# EAGLE design OC2_2boards (EAGLE 7.7.0)
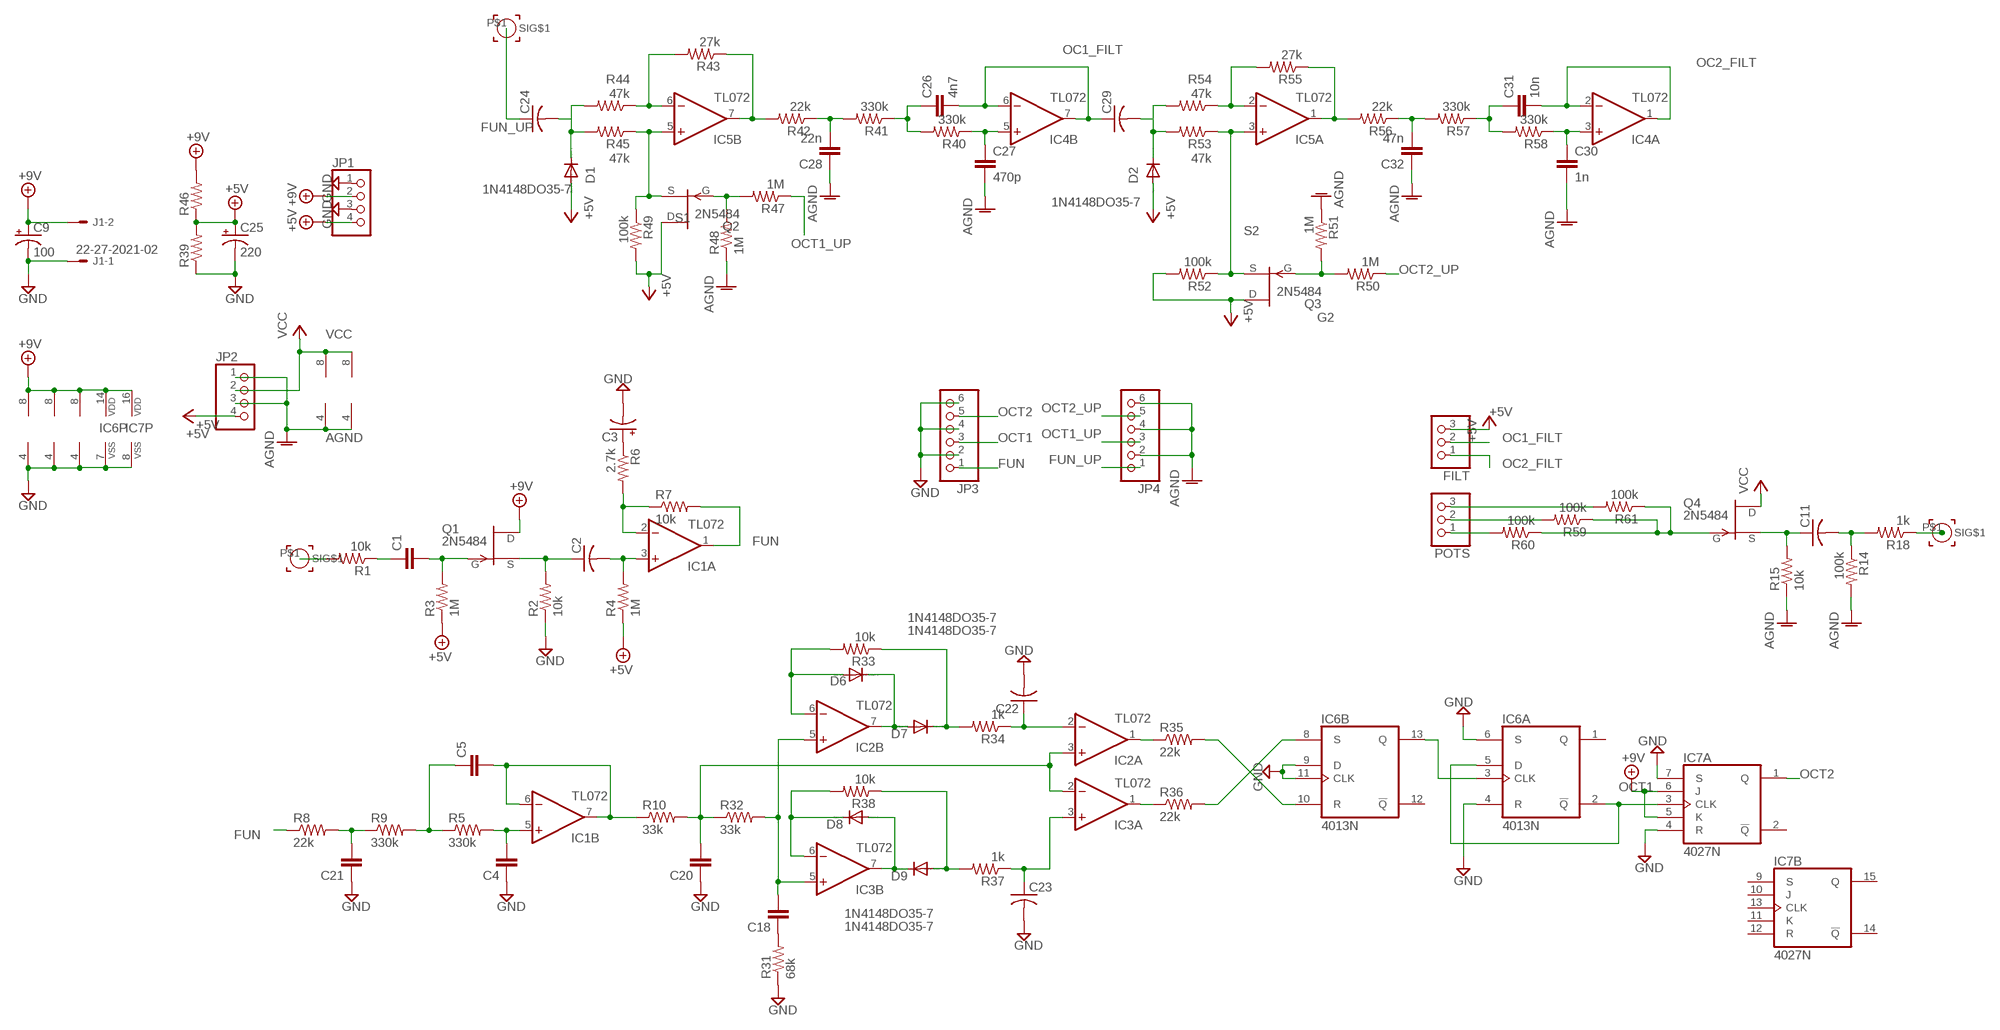
[diagram p0: schematic, sheet 1]

## Parts
C1  C-EU  [C025-025X050-BP]
C2  C-US  [C050-024X044-BP]
C3  CPOL-USE2.5-5  [E2,5-5]
C4  C-EU  [C025-025X050-BP]
C5  C-EU  [C025-025X050-BP]
C9  100  CPOL-USE2.5-6  [E2,5-6]
C11  C-US  [C050-024X044-BP]
C18  C-EU  [C025-025X050-BP]
C20  C-EU  [C025-025X050-BP]
C21  C-EU  [C025-025X050-BP]
C22  C-US  [C050-024X044-BP]
C23  C-US  [C050-024X044-BP]
C24  C-US  [C050-024X044-BP]
C25  220  CPOL-USE3.5-8  [E3,5-8]
C26  4n7  C-EU  [C025-025X050-BP]
C27  470p  C-EU  [C025-025X050-BP]
C28  22n  C-EU  [C025-025X050-BP]
C29  C-US  [C050-024X044-BP]
C30  1n  C-EU  [C025-025X050-BP]
C31  10n  C-EU  [C025-025X050-BP]
C32  47n  C-EU  [C025-025X050-BP]
D1  1N4148DO35-7  [DO35-7]
D2  1N4148DO35-7  [DO35-7]
D6  1N4148DO35-7  [DO35-7]
D7  1N4148DO35-7  [DO35-7]
D8  1N4148DO35-7  [DO35-7]
D9  1N4148DO35-7  [DO35-7]
FILT  PINHD-1X3  [1X03]
IC1  TL072  [DIL08-BP]
IC2  TL072  [DIL08-BP]
IC3  TL072  [DIL08-BP]
IC4  TL072  [DIL08-BP]
IC5  TL072  [DIL08-BP]
IC6  4013N  [DIL14]
IC7  4027N  [DIL16]
INPUT  SIGNAL_PAD  [SIGNAL_PAD]
INPUT1  SIGNAL_PAD  [SIGNAL_PAD]
INPUT2  SIGNAL_PAD  [SIGNAL_PAD]
J1  22-27-2021-02  [6410-02]
JP1  PINHD-1X4  [1X04]
JP2  PINHD-1X4  [1X04]
JP3  PINHD-1X6  [1X06]
JP4  PINHD-1X6  [1X06]
POTS  PINHD-1X3  [1X03]
Q1  2N5484  [TO92-]
Q2  2N5484  [TO92-]
Q3  2N5484  [TO92-]
Q4  2N5484  [TO92-]
R1  10k  R-US_0204/2V-BP  [0204V-BP]
R2  10k  R-US_0204/2V-BP  [0204V-BP]
R3  1M  R-US_0204/2V-BP  [0204V-BP]
R4  1M  R-US_0204/5-BP  [0204/5-BP]
R5  330k  R-US_0204/2V-BP  [0204V-BP]
R6  2.7k  R-US_0204/2V-BP  [0204V-BP]
R7  10k  R-US_0204/2V-BP  [0204V-BP]
R8  22k  R-US_0204/2V  [0204V]
R9  330k  R-US_0204/5-BP  [0204/5-BP]
R10  33k  R-US_0204/2V-BP  [0204V-BP]
R14  100k  R-US_0204/5-BP  [0204/5-BP]
R15  10k  R-US_0204/2V-BP  [0204V-BP]
R18  1k  R-US_0204/2V-BP  [0204V-BP]
R31  68k  R-US_0204/2V-BP  [0204V-BP]
R32  33k  R-US_0204/2V-BP  [0204V-BP]
R33  10k  R-US_0204/2V-BP  [0204V-BP]
R34  1k  R-US_0204/2V-BP  [0204V-BP]
R35  22k  R-US_0204/5-BP  [0204/5-BP]
R36  22k  R-US_0204/5-BP  [0204/5-BP]
R37  1k  R-US_0204/2V-BP  [0204V-BP]
R38  10k  R-US_0204/2V-BP  [0204V-BP]
R39  R-US_0204/2V-BP  [0204V-BP]
R40  330k  R-US_0204/2V-BP  [0204V-BP]
R41  330k  R-US_0204/2V-BP  [0204V-BP]
R42  22k  R-US_0204/5-BP  [0204/5-BP]
R43  27k  R-US_0204/2V-BP  [0204V-BP]
R44  47k  R-US_0204/2V-BP  [0204V-BP]
R45  47k  R-US_0204/2V-BP  [0204V-BP]
R46  R-US_0204/2V-BP  [0204V-BP]
R47  1M  R-US_0204/5-BP  [0204/5-BP]
R48  1M  R-US_0204/5-BP  [0204/5-BP]
R49  100k  R-US_0204/2V-BP  [0204V-BP]
R50  1M  R-US_0204/5-BP  [0204/5-BP]
R51  1M  R-US_0204/5-BP  [0204/5-BP]
R52  100k  R-US_0204/2V-BP  [0204V-BP]
R53  47k  R-US_0204/2V-BP  [0204V-BP]
R54  47k  R-US_0204/2V-BP  [0204V-BP]
R55  27k  R-US_0204/2V-BP  [0204V-BP]
R56  22k  R-US_0204/5-BP  [0204/5-BP]
R57  330k  R-US_0204/2V-BP  [0204V-BP]
R58  330k  R-US_0204/2V-BP  [0204V-BP]
R59  100k  R-US_0204/2V-BP  [0204V-BP]
R60  100k  R-US_0204/2V-BP  [0204V-BP]
R61  100k  R-US_0204/2V-BP  [0204V-BP]

## Nets
+5V: C25.+ D1.A D2.A FILT.3 JP1.4 JP2.4 Q2.3(D) Q3.3(D) R3.1 R4.1 R39.2 R46.1 R49.2 R52.2
+9V: C9.+ IC1.8(P:V+) IC2.8(P:V+) IC3.8(P:V+) IC6.14(P:VDD) IC7.5(A:K) IC7.6(A:J) IC7.16(P:VDD) J1.2 JP1.2 Q1.3(D) R46.2
AGND: C27.2 C28.1 C30.2 C32.1 IC4.4(P:V-) IC5.4(P:V-) JP2.1 JP2.3 JP4.2 JP4.4 JP4.6 R14.2 R15.1 R48.1 R51.1
FUN: IC1.1(A:OUT) JP3.1 R7.2 R8.1
FUN_UP: C24.1 INPUT2.P$1(SIG$1) JP4.1
G1: Q2.1(G) R47.2 R48.2
G2: Q3.1(G) R50.2 R51.2
GND: C3.- C4.1 C9.- C20.1 C21.1 C22.2 C23.2 C25.- IC1.4(P:V-) IC2.4(P:V-) IC3.4(P:V-) IC6.4(A:R) IC6.6(A:S) IC6.7(P:VSS) IC6.9(B:D) IC6.11(B:CLK) IC7.4(A:R) IC7.7(A:S) IC7.8(P:VSS) J1.1 JP1.1 JP1.3 JP3.2 JP3.4 JP3.6 R2.1 R31.1 R39.1
N$1: IC1.2(A:-IN) R6.2 R7.1
N$2: C3.+ R6.1
N$4: C2.1 Q1.2(S) R2.2
N$5: C2.2 IC1.3(A:+IN) R4.2
N$6: IC6.8(B:S) R36.2
N$7: IC2.1(A:OUT) R35.1
N$8: IC3.1(A:OUT) R36.1
N$9: IC6.10(B:R) R35.2
N$10: INPUT.P$1(SIG$1) R1.2
N$11: IC6.3(A:CLK) IC6.13(B:Q)
N$13: C1.1 R1.1
N$14: C1.2 Q1.1(G) R3.2
N$15: C21.2 R8.2 R9.1
N$16: C5.1 R5.1 R9.2
N$17: C4.2 IC1.5(B:+IN) R5.2
N$18: C5.2 IC1.6(B:-IN) IC1.7(B:OUT) R10.1
N$19: C20.2 IC2.3(A:+IN) IC3.2(A:-IN) R10.2 R32.1
N$20: C18.2 IC2.5(B:+IN) IC3.5(B:+IN) R32.2
N$21: C18.1 R31.2
N$22: D8.C IC3.6(B:-IN) R38.2
N$23: D8.A D9.C IC3.7(B:OUT)
N$24: D6.C D7.A IC2.7(B:OUT)
N$25: D6.A IC2.6(B:-IN) R33.2
N$26: C22.1 IC2.2(A:-IN) R34.1
N$27: D9.A R37.2 R38.1
N$28: C23.1 IC3.3(A:+IN) R37.1
N$29: D7.C R33.1 R34.2
N$32: C24.2 D1.C R44.2 R45.2
N$33: C29.2 D2.C R53.2 R54.2
N$34: IC5.6(B:-IN) R43.2 R44.1
N$35: IC5.2(A:-IN) R54.1 R55.2
N$36: C11.1 Q4.2(S) R15.2
N$37: IC5.1(A:OUT) R55.1 R56.2
N$38: IC5.7(B:OUT) R42.2 R43.1
N$39: C30.1 IC4.3(A:+IN) R58.1
N$40: C27.1 IC4.5(B:+IN) R40.1
N$41: C26.1 R40.2 R41.1
N$42: C28.2 R41.2 R42.1
N$43: C31.1 R57.1 R58.2
N$44: C32.2 R56.1 R57.2
N$45: POTS.1 R60.2
N$48: POTS.2 R59.2
N$49: POTS.3 R61.2
N$50: Q4.1(G) R59.1 R60.1 R61.1
N$51: C11.2 R14.1 R18.2
N$52: INPUT1.P$1(SIG$1) R18.1
OC1_FILT: C26.2 C29.1 FILT.2 IC4.6(B:-IN) IC4.7(B:OUT)
OC2_FILT: C31.2 FILT.1 IC4.1(A:OUT) IC4.2(A:-IN)
OCT1: IC6.2(A:!Q) IC6.5(A:D) IC7.3(A:CLK) JP3.3
OCT1_UP: JP4.3 R47.1
OCT2: IC7.1(A:Q) JP3.5
OCT2_UP: JP4.5 R50.1
S1: IC5.5(B:+IN) Q2.2(S) R45.1 R49.1
S2: IC5.3(A:+IN) Q3.2(S) R52.1 R53.1
VCC: IC4.8(P:V+) IC5.8(P:V+) JP2.2 Q4.3(D)
Unconnected: IC6.1(A:Q) IC6.12(B:!Q) IC7.2(A:!Q) IC7.9(B:S) IC7.10(B:J) IC7.11(B:K) IC7.12(B:R) IC7.13(B:CLK) IC7.14(B:!Q) IC7.15(B:Q)

## Library data of the parts
C1 C4 C5 C18 C20 C21 C26-C28 C30-C32 = rcl:C-EU: CAPACITOR, European symbol
C2 C11 C22-C24 C29 = rcl:C-US: CAPACITOR, American symbol
C3 C9 C25 = rcl:CPOL-US: POLARIZED CAPACITOR, American symbol
D1 D2 D6-D9 = diode:1N4148: DIODE high speed (Philips)
FILT POTS = pinhead:PINHD-1X3: PIN HEADER
IC1-IC5 = linear:TL072: OP AMP
IC6 = 40xx:4013: Dual D FLIP FLOP, set/reset
IC7 = 40xx:4027: Dual JK FLIP FLOP
INPUT INPUT1 INPUT2 = SignalPad:SIGNAL_PAD
J1 = con-molex:22-?-02: CONNECTOR wire to board 2.54 mm (.1 inch) pitch header; OC_FARNELL: unknown; OC_NEWARK: unknown
JP1 JP2 = pinhead:PINHD-1X4: PIN HEADER
JP3 JP4 = pinhead:PINHD-1X6: PIN HEADER
Q1-Q4 = transistor-fet:?548*: N-Channel JFETs Source: VISHAY 2N5484.pdf Compatible: TO92 2N5245 J304 J305 U310 J308 J309 J310 TO72 2N4416 2N4416A 2N3823 2N4351 3N169 3N170 3N171 MFE3002 TO18 2N3796 2N3797 MFE825 Source: Motorola European Master Guide Pacge 3-59
R1-R10 R14 R15 R18 R31-R61 = rcl:R-US_: RESISTOR, American symbol

## Board
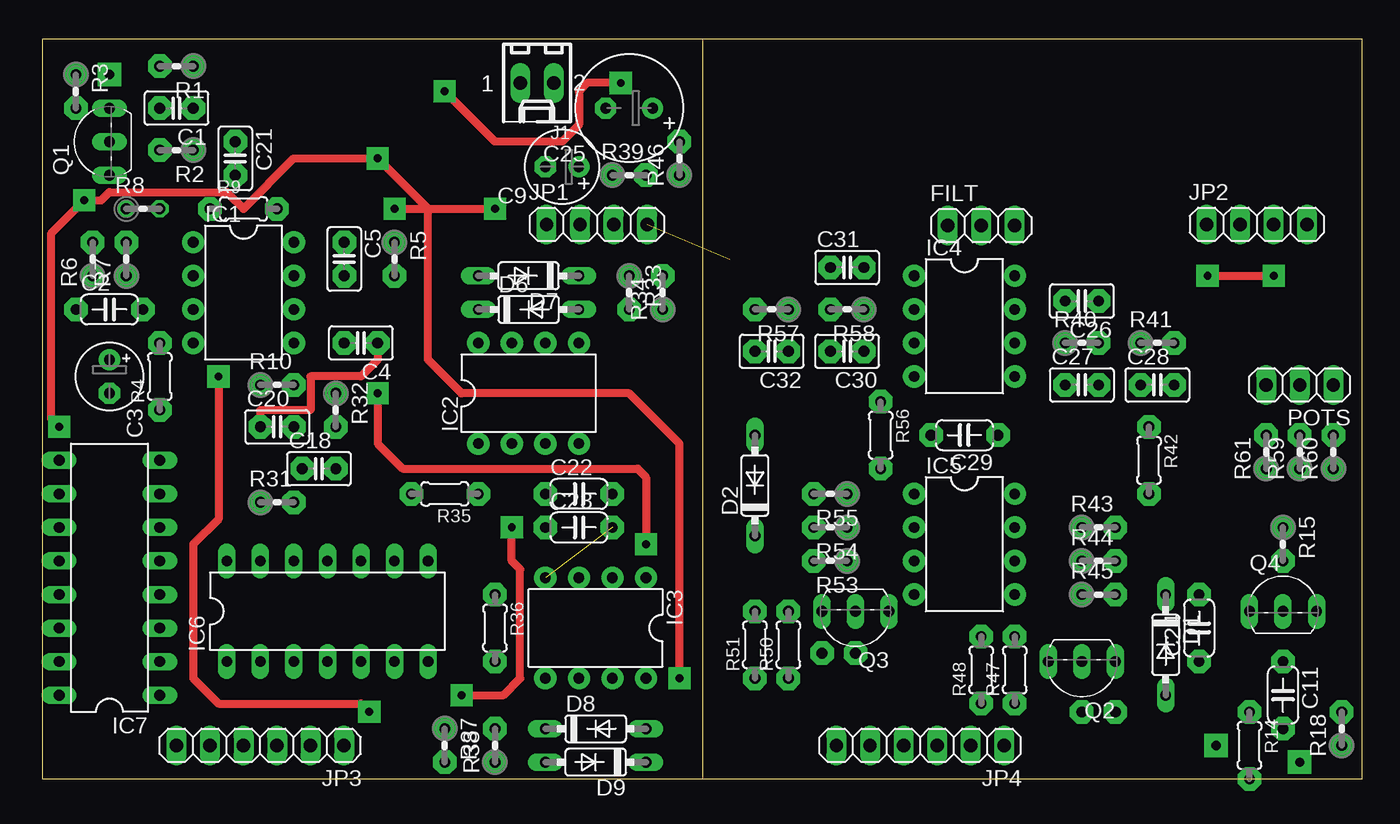
[diagram p1: board, top side]
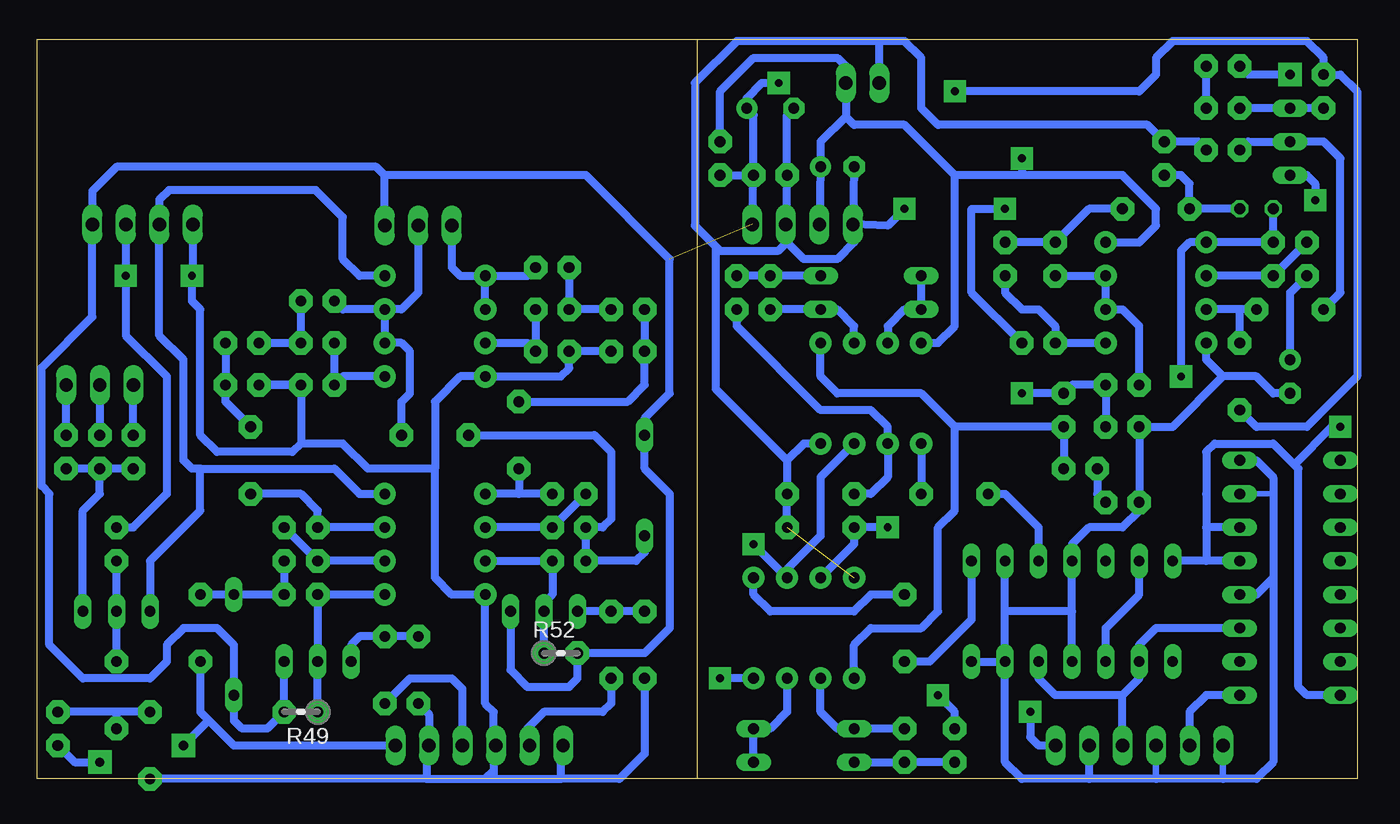
[diagram p2: board, bottom side, seen from below]

Size 100 x 56 mm. Coordinates in mm from the lower left corner, seen from the top.
Outline: 50,0 0,0 0,56 50,56
Outline: 50,0 100,0 100,56 50,56
Outline: 50,56 50,0
Copper layers (1*16): Top 0.035mm / dielectric 1.5mm / Bottom 0.035mm
Design rules "default": minimum track width 10mil, minimum drill 24mil, track to track 8mil, track to pad 8mil, pad to pad 8mil, via to via 8mil, smd to smd 8mil, copper to edge 40mil, drill to drill 8mil, minimum pad ring 10mil, minimum via ring 8mil, stop-mask expansion 4mil, vias tented up to drill 0mil, thermal gap 10mil

### Footprints (pad centres in the part's own frame; a part is rotated, then mirrored left to right if it is on the bottom)
C025-025X050-BP = drill 0.813 pad 1.778 octagon: 1 -1.27,0; 2 1.27,0
C050-024X044-BP = drill 0.813 pad 1.778 octagon: 1 -2.54,0; 2 2.54,0
E2,5-5 = drill 0.813 pad 1.6: + -1.27,0 | drill 0.813 pad 1.6 octagon: - 1.27,0
E2,5-6 = drill 0.813 pad 1.6: + -1.27,0 | drill 0.813 pad 1.6 octagon: - 1.27,0
E3,5-8 = drill 0.813 pad 1.6: + -1.778,0 | drill 0.813 pad 1.6 octagon: - 1.778,0
DO35-7 = drill 0.813 long: A 3.81,0; C -3.81,0
1X03 = drill 1.016 long: 1 -2.54,0; 2 0,0; 3 2.54,0
DIL08-BP = drill 0.813 pad 1.676: 1 -3.81,-3.81; 2 -1.27,-3.81; 3 1.27,-3.81; 4 3.81,-3.81; 5 3.81,3.81; 6 1.27,3.81; 7 -1.27,3.81; 8 -3.81,3.81
DIL14 = drill 0.813 long: 1 -7.62,-3.81; 2 -5.08,-3.81; 3 -2.54,-3.81; 4 0,-3.81; 5 2.54,-3.81; 6 5.08,-3.81; 7 7.62,-3.81; 8 7.62,3.81; 9 5.08,3.81; 10 2.54,3.81; 11 0,3.81; 12 -2.54,3.81; 13 -5.08,3.81; 14 -7.62,3.81
DIL16 = drill 0.813 long: 1 -8.89,-3.81; 2 -6.35,-3.81; 3 -3.81,-3.81; 4 -1.27,-3.81; 5 1.27,-3.81; 6 3.81,-3.81; 7 6.35,-3.81; 8 8.89,-3.81; 9 8.89,3.81; 10 6.35,3.81; 11 3.81,3.81; 12 1.27,3.81; 13 -1.27,3.81; 14 -3.81,3.81; 15 -6.35,3.81; 16 -8.89,3.81
SIGNAL_PAD = drill 0.7 pad 1.778 square: P$1 0,0
6410-02 = drill 1.016 long: 1 1.27,0; 2 -1.27,0
1X04 = drill 1.016 long: 1 -3.81,0; 2 -1.27,0; 3 1.27,0; 4 3.81,0
1X06 = drill 1.016 long: 1 -6.35,0; 2 -3.81,0; 3 -1.27,0; 4 1.27,0; 5 3.81,0; 6 6.35,0
TO92- = drill 0.813 long: 1 2.54,0; 2 0,0; 3 -2.54,0
0204V-BP = drill 0.813 pad 1.778 octagon: 1 -1.27,0; 2 1.27,0
0204/5-BP = drill 0.813 pad 1.778 octagon: 1 -2.54,0; 2 2.54,0
0204V = drill 0.813 octagon: 1 -1.27,0; 2 1.27,0

### Placement (x,y rotation side)
C1  10.16,50.8 180 top
C2  5.08,35.56 0 top
C3  5.08,30.48 270 top
C4  24.13,33.02 180 top
C5  22.86,39.37 270 top
C9  39.37,46.35 180 top
C11  93.98,6.35 270 top
C18  20.95,23.5 0 top
C20  17.78,26.67 0 top
C21  14.61,46.99 270 top
C22  40.64,21.59 0 top
C23  40.64,19.05 0 top
C24  87.63,11.43 90 top
C25  44.45,50.8 180 top
C26  78.74,36.2 180 top
C27  78.74,29.84 0 top
C28  84.45,29.84 0 top
C29  69.85,26.04 180 top
C30  60.96,32.38 180 top
C31  60.96,38.73 0 top
C32  55.24,32.38 180 top
D1  85.09,10.16 270 top
D2  53.98,22.23 90 top
D6  36.83,35.56 0 top
D7  36.83,38.1 180 top
D8  41.91,3.81 0 top
D9  41.91,1.27 180 top
FILT  71.12,41.91 0 top
IC1  15.24,36.83 270 top
IC2  36.83,29.21 0 top
IC3  41.91,11.43 180 top
IC4  69.85,34.29 270 top
IC5  69.85,17.78 270 top
IC6  21.59,12.7 0 top
IC7  5.08,15.24 90 top
INPUT  5.08,53.34 0 top
INPUT1  95.25,1.27 180 top
INPUT2  88.9,2.54 0 top
J1  37.47,52.7 180 top
JP1  42,42 0 top
JP2  92,42 0 top
JP3  16.5,2.54 180 top
JP4  66.5,2.54 180 top
POTS  95.25,29.84 180 top
Q1  5.08,48.26 90 top
Q2  78.74,8.89 180 top
Q3  61.59,12.7 180 top
Q4  93.98,12.7 0 top
R1  10.16,53.98 180 top
R2  10.16,47.62 180 top
R3  2.54,52.07 270 top
R4  8.89,30.48 90 top
R5  26.67,39.37 270 top
R6  3.81,39.37 90 top
R7  6.35,39.37 90 top
R8  7.62,43.18 0 top
R9  15.24,43.18 0 top
R10  17.78,29.84 0 top
R14  91.44,2.54 270 top
R15  93.98,17.78 270 top
R18  98.42,3.81 90 top
R31  17.78,20.95 0 top
R32  22.23,27.94 270 top
R33  44.45,36.83 270 top
R34  46.99,36.83 90 top
R35  30.48,21.59 180 top
R36  34.29,11.43 270 top
R37  30.48,2.54 270 top
R38  34.29,2.54 90 top
R39  44.45,45.72 0 top
R40  78.74,33.02 0 top
R41  84.45,33.02 0 top
R42  83.82,24.13 270 top
R43  80.01,19.05 0 top
R44  80.01,16.51 0 top
R45  80.01,13.97 0 top
R46  48.26,46.99 90 top
R47  73.66,8.26 90 top
R48  71.12,8.26 90 top
R49  80.01,5.08 180 bottom
R50  56.52,10.16 90 top
R51  53.98,10.16 90 top
R52  60.33,9.53 0 bottom
R53  59.69,16.51 180 top
R54  59.69,19.05 180 top
R55  59.69,21.59 180 top
R56  63.5,26.04 270 top
R57  55.24,35.56 180 top
R58  60.96,35.56 180 top
R59  95.25,24.77 90 top
R60  97.79,24.77 90 top
R61  92.71,24.77 90 top

### Tracks (layer width: path | path; a pad name or v marks a point on that pad's centre or on a via)
+5V  (via drill 0.6 pad 1.68)  (1 unrouted)
  Top 0.61: v30.48,52.07 34.29,48.26 39.37,48.26 40.64,49.53 40.64,52.07 41.27,52.7 v43.81,52.7
  Bottom 0.61: FILT.3 73.66,45.72 | R46.1 R39.2 | JP1.4 R39.2 | R39.2 45.72,50.29 C25.+ 46.23,51.56 45.09,52.7 v43.81,52.7 | R4.1 7.62,26.67 3.81,26.67 0,30.48 0,52.07 1.27,53.34 R3.1 2.54,54.61 3.81,55.88 13.97,55.88 15.24,54.61 15.24,53.34 16.51,52.07 v30.48,52.07 | 73.66,45.72 74.3,46.35 93.98,46.35 95.81,44.52 JP2.4 95.81,35 99.69,31.11 99.69,22.23 99.06,21.59 99.06,10.16 96.52,7.62 91.44,7.62 90.17,8.89 90.17,10.16 88.9,11.43 86.36,11.43 85.09,10.16 D1.A 85.09,4.45 84.45,3.81 82.55,3.81 R49.2 Q2.3 | Q3.3 64.14,8.26 62.87,6.99 59.69,6.99 59.05,7.62 R52.2 53.98,9.53 52.07,11.43 52.07,21.59 53.98,23.5 D2.A 53.98,27.3 52.07,29.21 52.07,39.37 58.42,45.72 73.66,45.72
+9V  (via drill 0.6 pad 1.68)
  Top 0.61: v1.27,26.67 0.64,27.3 0.64,41.27 v3.17,43.81 4.45,43.81 5.08,44.45 13.97,44.45 15.24,43.18 19.05,46.99 v25.4,46.99 29.21,43.18 29.21,31.75 31.75,29.21 44.45,29.21 48.26,25.4 v48.26,7.62
  Bottom 0.61: IC7.5 11.43,16.51 | 11.43,16.51 IC6.14 | 11.43,19.05 11.43,16.51 | IC7.6 11.43,19.05 | IC7.16 3.81,6.35 4.45,6.99 4.45,23.5 4.76,23.81 | 11.43,19.05 11.43,21.59 11.43,24.77 10.79,25.4 6.35,25.4 4.76,23.81 | R46.2 48.26,52.07 45.72,54.61 39.37,54.61 38.73,53.98 J1.2 38.73,50.16 | 38.73,50.16 40.64,48.26 C9.+ JP1.2 | IC2.8 31.75,33.02 30.48,34.29 30.48,45.72 | 30.48,45.72 34.29,49.53 38.1,49.53 38.73,50.16 | IC1.8 16.51,40.64 15.24,41.91 15.24,43.18 17.78,45.72 25.4,45.72 | 25.4,45.72 30.48,45.72 | v1.27,26.67 1.91,26.67 4.76,23.81 | IC3.8 v48.26,7.62 | v25.4,46.99 25.4,45.72 | Q1.3 3.81,45.72 3.17,45.09 v3.17,43.81
AGND  (via drill 0.6 pad 1.68)
  Top 0.61: v88.27,38.1 v93.27,38.1
  Bottom 0.61: C32.1 C30.2 59.69,31.11 60.33,30.48 IC4.4 67.94,30.48 69.85,28.57 69.85,23.5 | C27.2 C28.1 80.64,29.84 80.01,29.21 80.01,25.4 | JP2.3 v93.27,38.1 93.27,33.58 90.17,30.48 90.17,21.59 92.71,19.05 R15.1 | JP2.1 88.19,38.17 v88.27,38.1 88.27,36.2 87.63,35.56 87.63,26.04 86.36,24.77 80.64,24.77 80.01,25.4 | 70.48,0 R14.2 | R51.1 53.98,1.91 55.88,0 60.33,0 | 69.85,23.5 74.93,23.5 76.83,25.4 80.01,25.4 | 69.85,23.5 69.85,15.24 68.58,13.97 IC5.4 66.04,5.71 65.41,5.08 65.41,2.37 | JP4.4 65.41,2.37 | 70.48,0 70.48,2.37 JP4.2 70.31,4.91 R48.1 | JP4.6 60.33,2.37 60.33,0 | 65.41,0.64 65.41,0 | 70.48,0 66.04,0 | 66.04,0 60.33,0 | 65.41,2.37 65.41,0.64 | 65.41,0.64 66.04,0
FUN  (via drill 0.6 pad 1.68)
  Top 0.61: v13.34,30.48 13.34,19.68 11.43,17.78 11.43,7.62 13.34,5.71 24.13,5.71 v24.77,5.08
  Bottom 0.61: R8.1 R7.2 IC1.1 12.7,40.64 13.34,40.01 v13.34,30.48 | v24.77,5.08 24.77,3.17 24.13,2.54 JP3.1
FUN_UP
  Bottom 0.61: C24.1 87.63,5.08 87,4.45 | 87,4.45 85.09,2.54 JP4.1 | INPUT2.P$1 87,4.45
G1
  Bottom 0.61: R48.2 R47.2 75.56,10.79 76.2,10.16 Q2.1
G2
  Bottom 0.61: R51.2 R50.2 Q3.1
GND  (via drill 0.6 pad 1.68)  (1 unrouted)
  Top 0.61: v26.67,43.18 v34.29,43.18 | C4.1 25.4,31.75 24.13,30.48 20.32,30.48 20.32,27.94 16.51,27.94 C20.1
  Bottom 0.406: IC7.7 6.35,21.59
  Bottom 0.508: JP3.6 10.16,0 | JP3.4 15.24,0
  Bottom 0.61: IC7.4 7.62,13.97 6.35,15.24 | IC7.8 7.62,24.13 6.35,22.86 6.35,21.59 6.35,15.24 | 21.59,12.7 IC6.11 21.59,17.78 20.32,19.05 17.78,19.05 16.51,20.32 R31.1 C20.1 13.97,26.67 10.16,30.48 | IC6.6 26.67,12.7 | 26.67,12.7 IC6.9 | IC6.4 21.59,12.7 | 21.59,12.7 26.67,12.7 | IC6.7 IC6.6 | IC2.4 41.91,25.4 43.18,24.13 | 43.18,24.13 C22.2 C23.2 | C25.- 43.18,50.29 R39.1 JP1.3 43.18,40.64 | JP1.1 38.1,40.64 39.37,39.37 41.91,39.37 43.18,40.64 | R2.1 12.06,48.26 C21.1 15.88,49.53 31.75,49.53 33.02,50.8 33.02,54.61 34.29,55.88 36.2,55.88 | C3.- 6.35,29.21 7.62,30.48 10.16,30.48 | 10.16,30.48 11.43,31.75 IC1.4 | J1.1 36.2,55.88 | 36.2,55.88 46.99,55.88 50.16,52.7 50.16,41.91 48.58,40.32 | 48.58,40.32 48.26,40.01 43.81,40.01 43.18,40.64 | JP3.2 20.32,0 | 20.32,0 25.4,0 26.67,1.27 IC6.6 | 20.32,0 15.24,0 10.16,0 7.62,0 6.35,1.27 6.35,15.24 | C9.- JP1.1 | 43.18,24.13 48.58,29.53 48.58,40.32 | C4.1 29.21,36.83 29.21,43.18 v26.67,43.18 | v34.29,43.18 35.56,41.91 JP1.1
N$1
  Bottom 0.61: R6.2 R7.1 IC1.2
N$2
  Bottom 0.61: C3.+ 5.08,36.83 R6.1
N$4
  Bottom 0.61: C2.1 1.27,36.83 1.27,46.99 2.54,48.26 Q1.2 8.26,48.26 R2.2
N$5
  Bottom 0.61: C2.2 8.89,35.56 | 8.89,35.56 IC1.3 | R4.2 8.89,35.56
N$6
  Bottom 0.61: IC6.8 29.21,12.06 32.38,8.89 R36.2
N$7
  Bottom 0.61: IC2.1 R35.1
N$8
  Bottom 0.61: R36.1 36.83,13.97 38.1,12.7 44.45,12.7 45.72,13.97 IC3.1
N$9
  Bottom 0.61: R35.2 26.67,21.59 24.13,19.05 IC6.10
N$10
  Bottom 0.61: INPUT.P$1 8.26,53.34 R1.2
N$11
  Bottom 0.61: IC6.3 19.05,11.43 16.51,13.97 IC6.13
N$13
  Bottom 0.61: C1.1 R1.1
N$14
  Bottom 0.61: R3.2 Q1.1 C1.2
N$15
  Bottom 0.61: R8.2 R9.1 12.7,45.09 13.34,45.72 C21.2
N$16
  Bottom 0.61: R9.2 20.32,43.18 C5.1 R5.1
N$17
  Bottom 0.61: IC1.5 C4.2 22.86,34.29 24.13,35.56 25.4,35.56 26.67,36.83 R5.2
N$18
  Bottom 0.61: C5.2 IC1.7 IC1.6 17.78,35.56 16.51,34.29 R10.1
N$19  (via drill 0.6 pad 1.68)
  Top 0.61: v25.4,29.21 25.4,25.4 27.3,23.5 45.09,23.5 45.72,22.86 v45.72,17.78
  Bottom 0.61: C20.2 R10.2 21.59,29.84 R32.1 v25.4,29.21 | IC2.3 40.64,22.86 40.64,18.41 43.18,15.88 IC3.2 v45.72,17.78
N$20
  Bottom 0.61: 30.48,26.67 R32.2 C18.2 | 30.48,26.67 33.02,29.21 39.37,29.21 40.64,30.48 IC2.5 | IC3.5 38.1,10.16 36.83,11.43 33.02,11.43 31.75,12.7 31.75,19.05 30.48,20.32 30.48,26.67
N$21
  Bottom 0.61: C18.1 19.68,21.59 R31.2
N$22
  Bottom 0.61: IC3.6 40.64,5.08 39.37,3.81 D8.C R38.2
N$23
  Bottom 0.61: IC3.7 43.18,5.08 44.45,3.81 D8.A D9.C
N$24
  Bottom 0.61: IC2.7 35.56,34.29 34.29,35.56 D6.C D7.A
N$25
  Bottom 0.61: IC2.6 38.1,34.29 39.37,35.56 D6.A R33.2
N$26
  Bottom 0.61: C22.1 36.83,21.59 35.56,22.86 IC2.2 35.56,26.67 36.83,27.94 40.64,27.94 46.99,34.29 R34.1
N$27
  Bottom 0.61: D9.A R38.1 R37.2
N$28  (via drill 0.6 pad 1.68)
  Top 0.61: v31.75,6.35 34.92,6.35 36.2,7.62 36.2,15.88 35.56,16.51 v35.56,19.05
  Bottom 0.61: IC3.3 38.1,17.78 C23.1 v35.56,19.05 | R37.1 30.48,5.08 v31.75,6.35
N$29
  Bottom 0.61: D7.C R33.1 R34.2
N$32
  Bottom 0.61: R44.2 R45.2 D1.C C24.2
N$33
  Bottom 0.61: C29.2 57.78,26.04 56.52,24.77 56.52,19.68 57.15,19.05 R54.2 R53.2 54.61,16.51 53.98,17.14 D2.C
N$34
  Bottom 0.61: IC5.6 R44.1 R43.2
N$35
  Bottom 0.61: IC5.2 R54.1 R55.2
N$36
  Bottom 0.61: R15.2 Q4.2 C11.1
N$37
  Bottom 0.61: R55.1 63.5,21.59 | 63.5,21.59 IC5.1 | R56.2 63.5,21.59
N$38
  Bottom 0.61: IC5.7 R43.1 78.74,20.32 80.01,21.59 R42.2
N$39
  Bottom 0.61: R58.1 C30.1 62.87,33.02 IC4.3
N$40
  Bottom 0.61: R40.1 C27.1 76.83,30.48 IC4.5
N$41
  Bottom 0.61: R41.1 R40.2 C26.1
N$42
  Bottom 0.61: R41.2 C28.2 85.72,28.57 R42.1
N$43
  Bottom 0.61: C31.1 R58.2 R57.1
N$44
  Bottom 0.61: R57.2 C32.2 53.98,29.84 55.24,28.57 R56.1
N$45
  Bottom 0.61: R60.2 POTS.1
N$48
  Bottom 0.61: POTS.2 R59.2
N$49
  Bottom 0.61: R61.2 POTS.3
N$50
  Bottom 0.61: R59.1 R60.1 | R61.1 R59.1 | Q4.1 96.52,20.32 95.25,21.59 R59.1
N$51
  Bottom 0.61: C11.2 93.98,5.08 R14.1 R18.2
N$52
  Bottom 0.61: R18.1 97.16,1.27 INPUT1.P$1
OC1_FILT
  Bottom 0.61: IC4.7 IC4.6 72.39,33.02 71.75,32.38 71.75,29.21 72.39,28.57 C29.1 | FILT.2 71.12,36.83 72.39,35.56 IC4.7 | IC4.7 76.83,35.56 C26.2
OC2_FILT
  Bottom 0.61: IC4.2 IC4.1 | FILT.1 68.58,38.73 67.94,38.1 IC4.1 | IC4.1 62.87,38.1 C31.2
OCT1
  Bottom 0.61: 17.78,6.35 16.51,7.62 IC6.2 16.51,10.16 15.24,11.43 IC7.3 | 17.78,6.35 22.86,6.35 24.13,7.62 IC6.5 | JP3.3 17.78,6.35
OCT1_UP
  Bottom 0.61: R47.1 71.75,7.62 68.58,7.62 67.77,6.81 JP4.3
OCT2
  Bottom 0.61: IC7.1 11.43,6.35 12.7,5.08 JP3.5
OCT2_UP
  Bottom 0.61: JP4.5 62.87,2.71 62.87,3.81 61.59,5.08 57.15,5.08 56.52,5.71 R50.1
S1
  Bottom 0.61: IC5.5 R45.1 Q2.2 R49.1
S2
  Bottom 0.61: IC5.3 R53.1 60.96,13.97 61.59,13.34 Q3.2 R52.1
VCC
  Bottom 0.61: IC5.8 75.56,21.59 77.47,23.5 87.63,23.5 | 87.63,23.5 87.63,20.32 91.44,16.51 Q4.3 | 87.63,23.5 88.27,23.5 88.9,24.13 88.9,31.75 90.73,33.58 JP2.2 90.73,43.87 90,44.6 78.89,44.6 76.83,42.55 76.83,39.37 75.56,38.1 IC4.8